# Altium schematic sheet ComBoard.SchDoc
size A4
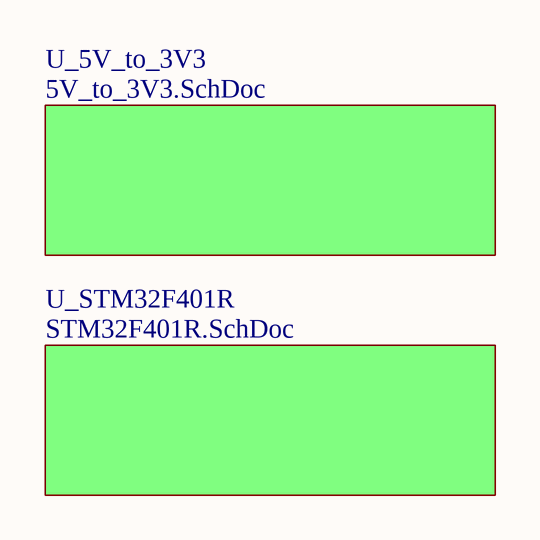
[diagram p0: ComBoard.SchDoc]

## Sub-sheets
U_5V_to_3V3 = 5V_to_3V3.SchDoc: no entries
U_STM32F401R = STM32F401R.SchDoc: no entries